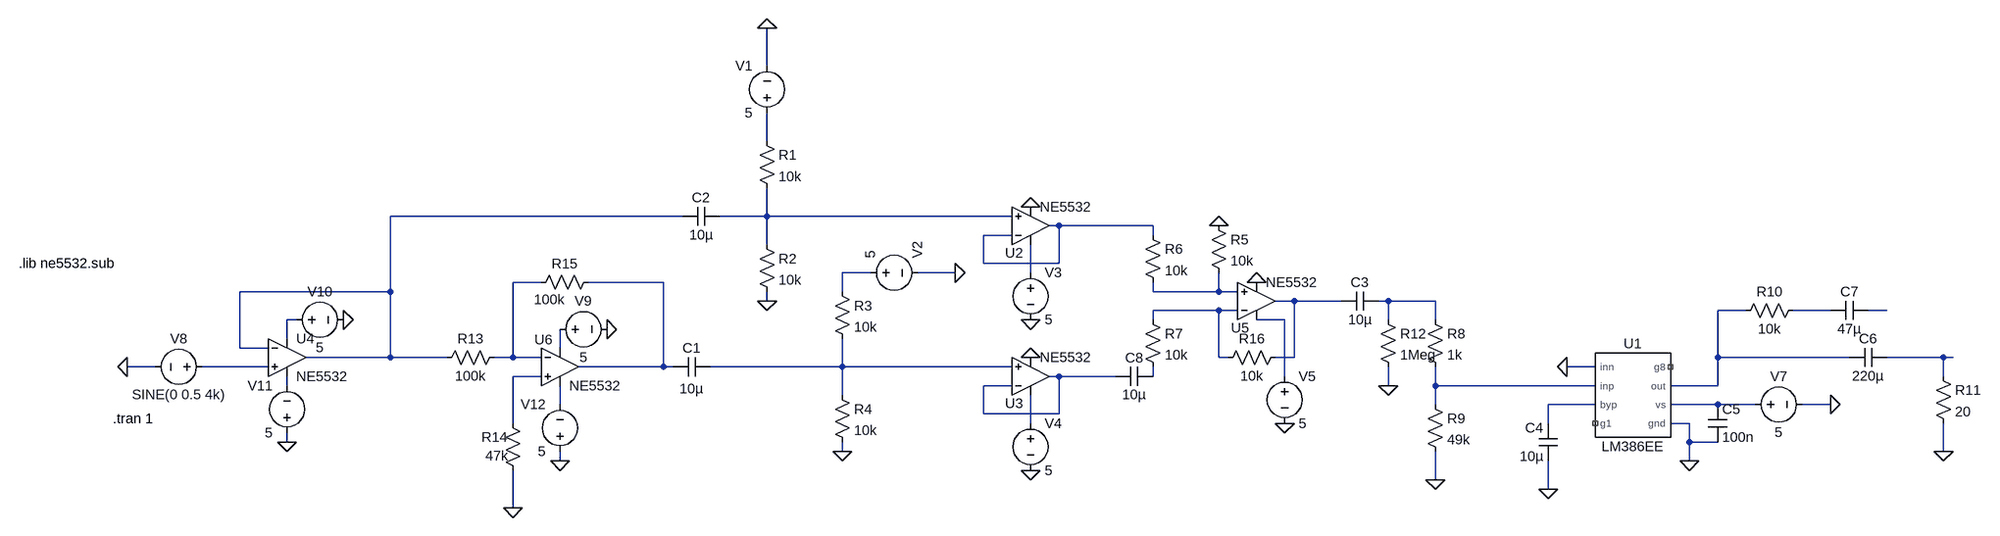
[diagram p0: schematic TestingAudio.asc]
TestingAudio.asc, the LTspice schematic file:
Version 4
SHEET 1 2532 984
WIRE 272 0 272 -64
WIRE 272 128 272 80
WIRE 128 256 -368 256
WIRE 272 256 272 208
WIRE 272 256 192 256
WIRE 688 256 272 256
WIRE 768 272 752 272
WIRE 928 272 768 272
WIRE 688 288 640 288
WIRE 928 288 928 272
WIRE 272 304 272 256
WIRE 640 336 640 288
WIRE 768 336 768 272
WIRE 768 336 640 336
WIRE 448 352 400 352
WIRE 592 352 528 352
WIRE 720 352 720 304
WIRE -112 368 -160 368
WIRE 96 368 -32 368
WIRE -368 384 -368 256
WIRE -368 384 -624 384
WIRE 400 384 400 352
WIRE 928 384 928 368
WIRE 1040 384 1040 352
WIRE 1040 384 928 384
WIRE 1072 384 1040 384
WIRE 272 400 272 384
WIRE 1168 400 1136 400
WIRE 1248 400 1168 400
WIRE 1328 400 1312 400
WIRE 1408 400 1328 400
WIRE 1040 416 928 416
WIRE 1072 416 1040 416
WIRE 1936 416 1888 416
WIRE 2080 416 2016 416
WIRE 2176 416 2144 416
WIRE -528 432 -544 432
WIRE 928 432 928 416
WIRE 1152 432 1104 432
WIRE 1328 432 1328 400
WIRE 1408 432 1408 400
WIRE -544 464 -544 432
WIRE -624 480 -624 384
WIRE -576 480 -624 480
WIRE -80 480 -80 448
WIRE -368 496 -368 384
WIRE -368 496 -512 496
WIRE -272 496 -368 496
WIRE -160 496 -160 368
WIRE -160 496 -192 496
WIRE -112 496 -160 496
WIRE 1040 496 1040 416
WIRE 1056 496 1040 496
WIRE 1168 496 1168 400
WIRE 1168 496 1136 496
WIRE 1888 496 1888 416
WIRE 2112 496 1888 496
WIRE 2272 496 2176 496
WIRE 2288 496 2272 496
WIRE -768 512 -816 512
WIRE -576 512 -688 512
WIRE 96 512 96 368
WIRE 96 512 -48 512
WIRE 112 512 96 512
WIRE 400 512 400 464
WIRE 400 512 176 512
WIRE 688 512 400 512
WIRE 1680 512 1632 512
WIRE -112 528 -160 528
WIRE 768 528 752 528
WIRE 864 528 768 528
WIRE 928 528 928 512
WIRE 1152 528 1152 432
WIRE 2272 528 2272 496
WIRE -544 544 -544 528
WIRE 688 544 640 544
WIRE 1328 544 1328 512
WIRE 1408 544 1408 512
WIRE 1680 544 1408 544
WIRE 1888 544 1888 496
WIRE 1888 544 1808 544
WIRE 400 560 400 512
WIRE -80 576 -80 544
WIRE 1408 576 1408 544
WIRE 1680 576 1600 576
WIRE 1888 576 1808 576
WIRE 1952 576 1888 576
WIRE 2080 576 2032 576
WIRE 640 592 640 544
WIRE 768 592 768 528
WIRE 768 592 640 592
WIRE -160 608 -160 528
WIRE 720 608 720 560
WIRE 1600 608 1600 576
WIRE 1840 608 1808 608
WIRE -544 640 -544 624
WIRE 1840 640 1840 608
WIRE 1888 640 1840 640
WIRE 400 656 400 640
WIRE 2272 656 2272 608
WIRE -80 672 -80 656
WIRE 1840 672 1840 640
WIRE 1408 704 1408 656
WIRE 1600 720 1600 672
WIRE -160 752 -160 688
FLAG 1408 704 0
FLAG 1632 512 0
FLAG 1600 720 0
FLAG 1840 672 0
FLAG 2080 576 0
FLAG -816 512 0
FLAG -160 752 0
FLAG 0 448 0
FLAG -448 432 0
FLAG -544 640 0
FLAG -80 672 0
FLAG 272 -64 0
FLAG 272 400 0
FLAG 592 352 0
FLAG 400 656 0
FLAG 720 432 0
FLAG 720 688 0
FLAG 720 496 0
FLAG 720 240 0
FLAG 1040 272 0
FLAG 1152 608 0
FLAG 1104 368 0
FLAG 2272 656 0
FLAG 1328 544 0
SYMBOL cap 1312 384 R90
WINDOW 0 0 32 VBottom 2
WINDOW 3 32 32 VTop 2
SYMATTR InstName C3
SYMATTR Value 10µ
SYMBOL res 1392 416 R0
SYMATTR InstName R8
SYMATTR Value 1k
SYMBOL res 1392 560 R0
SYMATTR InstName R9
SYMATTR Value 49k
SYMBOL cap 1616 672 R180
WINDOW 0 24 56 Left 2
WINDOW 3 24 8 Left 2
SYMATTR InstName C4
SYMATTR Value 10µ
SYMBOL voltage 1936 576 R270
WINDOW 0 32 56 VTop 2
WINDOW 3 -32 56 VBottom 2
WINDOW 123 0 0 Left 0
WINDOW 39 0 0 Left 0
SYMATTR InstName V7
SYMATTR Value 5
SYMBOL cap 1872 576 R0
SYMATTR InstName C5
SYMATTR Value 100n
SYMBOL cap 2176 480 R90
WINDOW 0 0 32 VBottom 2
WINDOW 3 32 32 VTop 2
SYMATTR InstName C6
SYMATTR Value 220µ
SYMBOL res 2032 400 R90
WINDOW 0 0 56 VBottom 2
WINDOW 3 32 56 VTop 2
SYMATTR InstName R10
SYMATTR Value 10k
SYMBOL cap 2144 400 R90
WINDOW 0 0 32 VBottom 2
WINDOW 3 32 32 VTop 2
SYMATTR InstName C7
SYMATTR Value 47µ
SYMBOL voltage -672 512 R90
WINDOW 0 -32 56 VBottom 2
WINDOW 3 32 56 VTop 2
WINDOW 123 0 0 Left 0
WINDOW 39 0 0 Left 0
SYMATTR InstName V8
SYMATTR Value SINE(0 0.5 4k)
SYMBOL OpAmps\\opamp2 -544 432 R0
SYMATTR InstName U4
SYMATTR Value NE5532
SYMBOL res -176 480 R90
WINDOW 0 0 56 VBottom 2
WINDOW 3 32 56 VTop 2
SYMATTR InstName R13
SYMATTR Value 100k
SYMBOL OpAmps\\opamp2 -80 448 R0
WINDOW 0 -43 18 Left 2
SYMATTR InstName U6
SYMATTR Value NE5532
SYMBOL res -176 592 R0
WINDOW 0 -37 40 Left 2
WINDOW 3 -31 71 Left 2
SYMATTR InstName R14
SYMATTR Value 47k
SYMBOL res -16 352 R90
WINDOW 0 0 56 VBottom 2
WINDOW 3 30 82 VTop 2
SYMATTR InstName R15
SYMATTR Value 100k
SYMBOL voltage -96 448 R270
WINDOW 0 32 56 VTop 2
WINDOW 3 -32 56 VBottom 2
WINDOW 123 0 0 Left 0
WINDOW 39 0 0 Left 0
SYMATTR InstName V9
SYMATTR Value 5
SYMBOL voltage -544 432 R270
WINDOW 0 32 56 VTop 2
WINDOW 3 -32 56 VBottom 2
WINDOW 123 0 0 Left 0
WINDOW 39 0 0 Left 0
SYMATTR InstName V10
SYMATTR Value 5
SYMBOL voltage -544 640 R180
WINDOW 0 24 96 Left 2
WINDOW 3 24 16 Left 2
WINDOW 123 0 0 Left 0
WINDOW 39 0 0 Left 0
SYMATTR InstName V11
SYMATTR Value 5
SYMBOL voltage -80 672 R180
WINDOW 0 24 96 Left 2
WINDOW 3 24 16 Left 2
WINDOW 123 0 0 Left 0
WINDOW 39 0 0 Left 0
SYMATTR InstName V12
SYMATTR Value 5
SYMBOL cap 176 496 R90
WINDOW 0 0 32 VBottom 2
WINDOW 3 38 32 VTop 2
SYMATTR InstName C1
SYMATTR Value 10µ
SYMBOL cap 192 240 R90
WINDOW 0 0 32 VBottom 2
WINDOW 3 32 32 VTop 2
SYMATTR InstName C2
SYMATTR Value 10µ
SYMBOL AutoGenerated\\LM386EE 1744 560 R0
SYMATTR InstName U1
SYMBOL res 256 112 R0
SYMATTR InstName R1
SYMATTR Value 10k
SYMBOL res 256 288 R0
SYMATTR InstName R2
SYMATTR Value 10k
SYMBOL voltage 272 96 R180
WINDOW 0 24 96 Left 2
WINDOW 3 24 16 Left 2
WINDOW 123 0 0 Left 0
WINDOW 39 0 0 Left 0
SYMATTR InstName V1
SYMATTR Value 5
SYMBOL res 384 368 R0
SYMATTR InstName R3
SYMATTR Value 10k
SYMBOL res 384 544 R0
SYMATTR InstName R4
SYMATTR Value 10k
SYMBOL voltage 432 352 R270
WINDOW 0 24 96 Left 2
WINDOW 3 24 16 Left 2
WINDOW 123 0 0 Left 0
WINDOW 39 0 0 Left 0
SYMATTR InstName V2
SYMATTR Value 5
SYMBOL OpAmps\\opamp2 720 336 M180
WINDOW 0 -43 18 Left 2
SYMATTR InstName U2
SYMATTR Value NE5532
SYMBOL OpAmps\\opamp2 720 592 M180
WINDOW 0 -43 18 Left 2
SYMATTR InstName U3
SYMATTR Value NE5532
SYMBOL voltage 720 336 R0
WINDOW 123 0 0 Left 0
WINDOW 39 0 0 Left 0
SYMATTR InstName V3
SYMATTR Value 5
SYMBOL voltage 720 592 R0
WINDOW 123 0 0 Left 0
WINDOW 39 0 0 Left 0
SYMATTR InstName V4
SYMATTR Value 5
SYMBOL cap 928 512 R90
WINDOW 0 0 32 VBottom 2
WINDOW 3 32 32 VTop 2
SYMATTR InstName C8
SYMATTR Value 10µ
SYMBOL OpAmps\\opamp2 1104 464 M180
WINDOW 0 -43 18 Left 2
SYMATTR InstName U5
SYMATTR Value NE5532
SYMBOL res 1024 256 R0
SYMATTR InstName R5
SYMATTR Value 10k
SYMBOL res 912 272 R0
SYMATTR InstName R6
SYMATTR Value 10k
SYMBOL res 912 416 R0
SYMATTR InstName R7
SYMATTR Value 10k
SYMBOL res 1152 480 R90
WINDOW 0 0 56 VBottom 2
WINDOW 3 32 56 VTop 2
SYMATTR InstName R16
SYMATTR Value 10k
SYMBOL voltage 1152 512 R0
WINDOW 123 0 0 Left 0
WINDOW 39 0 0 Left 0
SYMATTR InstName V5
SYMATTR Value 5
SYMBOL res 2256 512 R0
SYMATTR InstName R11
SYMATTR Value 20
SYMBOL res 1312 416 R0
SYMATTR InstName R12
SYMATTR Value 1Meg
TEXT -840 600 Left 2 !.tran 1
TEXT -1000 336 Left 2 !.lib ne5532.sub

The netlist it stands for:
* TestingAudio.asc
C3 N011 N010 10µ
R8 N011 N026 1k
R9 N026 0 49k
C4 0 N028 10µ
V7 N029 0 5
C5 N029 0 100n
C6 N019 N013 220µ
R10 N014 N013 10k
C7 N015 N014 47µ
V8 N020 0 SINE(0 0.5 4k)
XU4 N020 N002 N016 N025 N002 NE5532  ; pins In+ In- V+ V- OUT
R13 N007 N002 100k
XU6 N022 N007 N018 N027 N008 NE5532  ; pins In+ In- V+ V- OUT
R14 N022 0 47k
R15 N008 N007 100k
V9 N018 0 5
V10 N016 0 5
V11 0 N025 5
V12 0 N027 5
C1 N021 N008 10µ
C2 N003 N002 10µ
XU1 0 N026 N028 NC_01 NC_02 N013 N029 0 LM386EE  ; pins inn inp byp g1 g8 out vs gnd
R1 N001 N003 10k
R2 N003 0 10k
V1 N001 0 5
R3 N005 N021 10k
R4 N021 0 10k
V2 N005 0 5
XU2 N003 N004 N006 0 N004 NE5532  ; pins In+ In- V+ V- OUT
XU3 N021 N023 N030 0 N023 NE5532  ; pins In+ In- V+ V- OUT
V3 N006 0 5
V4 N030 0 5
C8 N024 N023 10µ
XU5 N009 N012 N017 0 N010 NE5532  ; pins In+ In- V+ V- OUT
R5 0 N009 10k
R6 N004 N009 10k
R7 N012 N024 10k
R16 N010 N012 10k
V5 N017 0 5
R11 N019 0 20
R12 N011 0 1Meg
.tran 1
.lib ne5532.sub
.lib C:\Users\USER\Documents\LTspice\LM386EE.sub
.backanno
.end